# Altium project EMG_MainBoard_Layout.PrjPcb
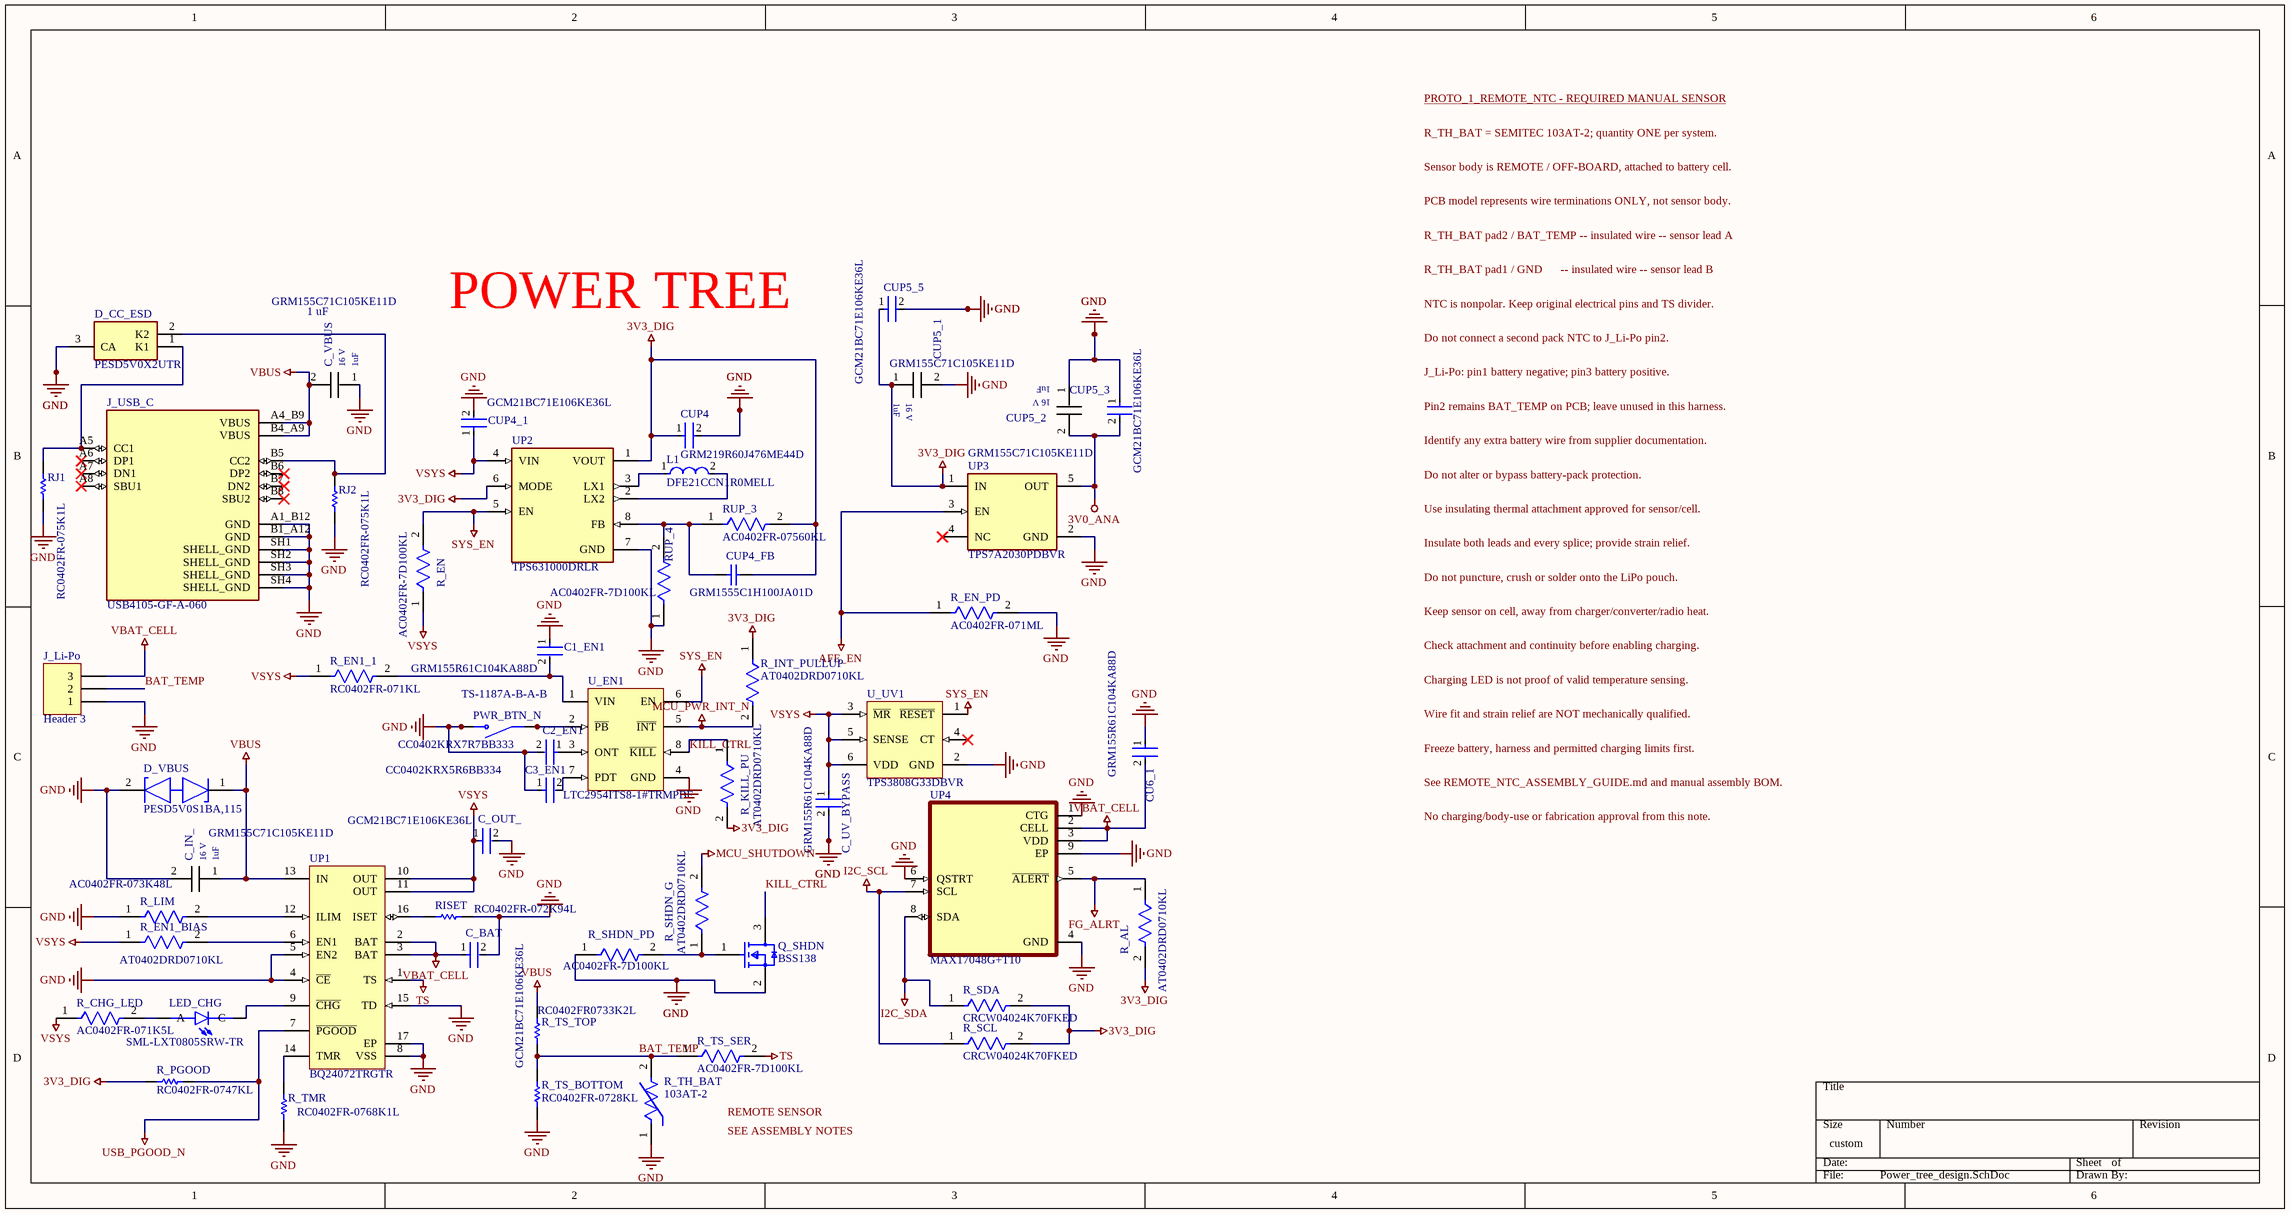
[diagram p0: Power_tree_design.SchDoc]
1 sheet, 54 parts. Net scope: flat (ports and power ports of the same name join across sheets).
Board file: EMG_MainBoard_Layout.PcbDoc

## Sheet Power_tree_design.SchDoc
size 457 x 241 mm; SheetNumber: 7; SheetTotal: 8; SPICEModelCacheDIZSBYRW: <root> / <DocumentId>DIZSBYRW</DocumentId> / </root>

### Parts
C1_EN1  GRM155R61C104KA88D  [FP-GRM155-0_05-IPC_C]
C2_EN1  CC0402KRX7R7BB333  [FP-CC0402-MFG]
C3_EN1  CC0402KRX5R6BB334  [FP-CC0402-MFG]
C_BAT  GCM21BC71E106KE36L  [FP-GCM21B-0_2-e0_2_0_7-MFG]
C_IN_  GRM155C71C105KE11D  [*MURATA_GRM155C71C105KE11D_0]
C_OUT_  GCM21BC71E106KE36L  [FP-GCM21B-0_2-e0_2_0_7-MFG]
C_UV_BYPASS  GRM155R61C104KA88D  [FP-GRM155-0_05-IPC_C]
C_VBUS  GRM155C71C105KE11D  value 1 uF  [*MURATA_GRM155C71C105KE11D_0]
CU6_1  GRM155R61C104KA88D  [FP-GRM155-0_05-IPC_C]
CUP4  GRM219R60J476ME44D  [FP-GRM219-0_2-0_1-IPC_A]
CUP4_1  GCM21BC71E106KE36L  [FP-GCM21B-0_2-e0_2_0_7-MFG]
CUP4_FB  GRM1555C1H100JA01D  [CAPC1005X55X25LL05T10]
CUP5_1  GRM155C71C105KE11D  [*MURATA_GRM155C71C105KE11D_0]
CUP5_2  GRM155C71C105KE11D  [*MURATA_GRM155C71C105KE11D_0]
CUP5_3  GCM21BC71E106KE36L  [FP-GCM21B-0_2-e0_2_0_7-MFG]
CUP5_5  GCM21BC71E106KE36L  [FP-GCM21B-0_2-e0_2_0_7-MFG]
D_CC_ESD  PESD5V0X2UTR  [SOT95P230X100-3N]
D_VBUS  PESD5V0S1BA,115  [FP-SOD323-CA-MFG]
J_Li-Po  Header 3  [HDR1X3]
J_USB_C  USB4105-GF-A-060  [GCT_USB4105-GF-A-060]
L1  DFE21CCN1R0MELL  [FP-DFE21CC_EL-MFG]
LED_CHG  SML-LXT0805SRW-TR  [LEDC2012X120N]
PWR_BTN_N  TS-1187A-B-A-B  [SW_TS-1187A-B-A-B]
Q_SHDN  BSS138  [FP-318-08-IPC_B]
R_AL  AT0402DRD0710KL  [FP-AT0402-IPC_A]
R_CHG_LED  AC0402FR-071K5L  [FP-AC0402-MFG]
R_EN  AC0402FR-7D100KL  [FP-AC0402-MFG]
R_EN1_1  RC0402FR-071KL  [FP-RC0402-0_4-IPC_A]
R_EN1_BIAS  AT0402DRD0710KL  [FP-AT0402-IPC_A]
R_EN_PD  AC0402FR-071ML  [FP-AC0402-IPC_A]
R_INT_PULLUP  AT0402DRD0710KL  [FP-AT0402-IPC_A]
R_KILL_PU  AT0402DRD0710KL  [FP-AT0402-IPC_A]
R_LIM  AC0402FR-073K48L  [FP-AC0402-MFG]
R_PGOOD  RC0402FR-0747KL  [RESC1005X40X25ML05T10]
R_SCL  CRCW04024K70FKED  [FP-CRCW0402-e3-IPC_B]
R_SDA  CRCW04024K70FKED  [FP-CRCW0402-e3-IPC_B]
R_SHDN_G  AT0402DRD0710KL  [FP-AT0402-IPC_A]
R_SHDN_PD  AC0402FR-7D100KL  [FP-AC0402-MFG]
R_TH_BAT  103AT-2  [EMG_REMOTE_NTC_TERMINALS_2P]
R_TMR  RC0402FR-0768K1L  [RESC1005X40X25ML05T10]
R_TS_BOTTOM  RC0402FR-0728KL  [RESC1005X40X25NL05T10]
R_TS_SER  AC0402FR-7D100KL  [FP-AC0402-MFG]
R_TS_TOP  RC0402FR0733K2L  [RESC1005X40X25NL05T10]
RISET  RC0402FR-072K94L  [RESC1005X40X25ML05T10]
RJ1  RC0402FR-075K1L  [RESC1005X40X25NL05T10]
RJ2  RC0402FR-075K1L  [RESC1005X40X25NL05T10]
RUP_3  AC0402FR-07560KL  [FP-AC0402-IPC_A]
RUP_4  AC0402FR-7D100KL  [FP-AC0402-MFG]
U_EN1  LTC2954ITS8-1#TRMPBF  [LT-TS8-8-TSOT-23_V]
U_UV1  TPS3808G33DBVR  [DBV0006A_L]
UP1  BQ24072TRGTR  [RGT0016C_V]
UP2  TPS631000DRLR  [SOT50P160X60-8N]
UP3  TPS7A2030PDBVR  [FP-DBV0005A-IPC_C]
UP4  MAX17048G+T10  [SON50P200X200X80-9N]

### Nets
3V0_ANA: CUP5_2.2 CUP5_3.2 UP3.5(OUT)
3V3_DIG: CUP4.1 CUP4_FB.2 CUP5_1.1 CUP5_5.1 R_AL.2 R_INT_PULLUP.1 R_KILL_PU.2 R_PGOOD.2 R_SCL.2 R_SDA.2 RUP_3.2 UP2.1(VOUT) UP2.6(MODE) UP3.1(IN)
AFE_EN: R_EN_PD.1 UP3.3(EN)
FG_ALRT: R_AL.1 UP4.5(~{ALERT})
GND: C1_EN1.1 C2_EN1.2 C3_EN1.1 C_BAT.2 C_IN_.2 C_OUT_.2 C_UV_BYPASS.2 C_VBUS.1 CU6_1.1 CUP4.2 CUP4_1.2 CUP5_1.2 CUP5_2.1 CUP5_3.1 CUP5_5.2 D_CC_ESD.3(CA) D_VBUS.2(K2) J_Li-Po.1 J_USB_C.A1_B12(GND) J_USB_C.B1_A12(GND) J_USB_C.SH1(SHELL_GND) J_USB_C.SH2(SHELL_GND) J_USB_C.SH3(SHELL_GND) J_USB_C.SH4(SHELL_GND) PWR_BTN_N.C(NO) PWR_BTN_N.D(NO) Q_SHDN.2(S) R_EN_PD.2 R_LIM.1 R_SHDN_PD.1 R_TH_BAT.1 R_TMR.1 R_TS_BOTTOM.1 RISET.2 RJ1.1 RJ2.1 RUP_4.1 U_EN1.4(GND) U_UV1.2(GND) UP1.4(~{CE}) UP1.5(EN2) UP1.8(VSS) UP1.15(TD) UP1.17(EP) UP2.7(GND) UP3.2(GND) UP4.1(CTG) UP4.4(GND) UP4.6(QSTRT) UP4.9(EP)
I2C_SCL: R_SCL.1 UP4.7(SCL)
I2C_SDA: R_SDA.1 UP4.8(SDA)
MCU_PWR_INT_N: R_INT_PULLUP.2 U_EN1.5(~{INT})
MCU_SHUTDOWN: R_SHDN_G.2
SYS_EN: R_EN.2 U_EN1.6(EN) U_UV1.1(~{RESET}) UP2.5(EN)
TS: R_TS_SER.2 UP1.1(TS)
USB_PGOOD_N: R_PGOOD.1 UP1.7(~{PGOOD})
VBAT_CELL: C_BAT.1 CU6_1.2 J_Li-Po.3 UP1.2(BAT) UP1.3(BAT) UP4.2(CELL) UP4.3(VDD)
VBUS: C_IN_.1 C_VBUS.2 D_VBUS.1(K1) J_USB_C.A4_B9(VBUS) J_USB_C.B4_A9(VBUS) R_TS_TOP.2 UP1.13(IN)
VSYS: C_OUT_.1 C_UV_BYPASS.1 CUP4_1.1 R_CHG_LED.1 R_EN.1 R_EN1_1.1 R_EN1_BIAS.1 U_UV1.3(~{MR}) U_UV1.5(SENSE) U_UV1.6(VDD) UP1.10(OUT) UP1.11(OUT) UP2.4(VIN)
BAT_TEMP: J_Li-Po.2 R_TH_BAT.2 R_TS_BOTTOM.2 R_TS_SER.1 R_TS_TOP.1
KILL_CTRL: Q_SHDN.3(D) R_KILL_PU.1 U_EN1.8(~{KILL})
NetC1_EN1_2: C1_EN1.2 R_EN1_1.2 U_EN1.1(VIN)
NetC2_EN1_1: C2_EN1.1 U_EN1.3(ONT)
NetC3_EN1_2: C3_EN1.2 U_EN1.7(PDT)
NetCUP4_FB_1: CUP4_FB.1 RUP_3.1 RUP_4.2 UP2.8(FB)
NetD_CC_ESD_1: D_CC_ESD.1(K1) J_USB_C.A5(CC1) RJ1.2
NetD_CC_ESD_2: D_CC_ESD.2(K2) J_USB_C.B5(CC2) RJ2.2
NetL1_1: L1.1 UP2.3(LX1)
NetL1_2: L1.2 UP2.2(LX2)
NetLED_CHG_A: LED_CHG.A R_CHG_LED.2
NetLED_CHG_C: LED_CHG.C UP1.9(~{CHG})
NetPWR_BTN_N_A: PWR_BTN_N.A(COM) PWR_BTN_N.B(COM) U_EN1.2(~{PB})
NetQ_SHDN_1: Q_SHDN.1(G) R_SHDN_G.1 R_SHDN_PD.2
NetR_EN1_BIAS_2: R_EN1_BIAS.2 UP1.6(EN1)
NetR_LIM_2: R_LIM.2 UP1.12(ILIM)
NetR_TMR_2: R_TMR.2 UP1.14(TMR)
NetRISET_1: RISET.1 UP1.16(ISET)

Not connected (* = marked no-connect by the designer): J_USB_C A6(DP1)* A7(DN1)* A8(SBU1)* B6(DP2)* B7(DN2)* B8(SBU2)*; U_UV1 4(CT)*; UP3 4(NC)*

### Notes on the sheet
- PROTO_1_REMOTE_NTC - REQUIRED MANUAL SENSOR
- R_TH_BAT = SEMITEC 103AT-2; quantity ONE per system.
- Sensor body is REMOTE / OFF-BOARD, attached to battery cell.
- PCB model represents wire terminations ONLY, not sensor body.
- R_TH_BAT pad2 / BAT_TEMP -- insulated wire -- sensor lead A
- R_TH_BAT pad1 / GND      -- insulated wire -- sensor lead B
- POWER TREE
- NTC is nonpolar. Keep original electrical pins and TS divider.
- Do not connect a second pack NTC to J_Li-Po pin2.
- J_Li-Po: pin1 battery negative; pin3 battery positive.
- Pin2 remains BAT_TEMP on PCB; leave unused in this harness.
- Identify any extra battery wire from supplier documentation.
- Do not alter or bypass battery-pack protection.
- Use insulating thermal attachment approved for sensor/cell.
- Insulate both leads and every splice; provide strain relief.
- Do not puncture, crush or solder onto the LiPo pouch.
- Keep sensor on cell, away from charger/converter/radio heat.
- Check attachment and continuity before enabling charging.
- Charging LED is not proof of valid temperature sensing.
- Wire fit and strain relief are NOT mechanically qualified.
- Freeze battery, harness and permitted charging limits first.
- See REMOTE_NTC_ASSEMBLY_GUIDE.md and manual assembly BOM.
- No charging/body-use or fabrication approval from this note.
- REMOTE SENSOR
- SEE ASSEMBLY NOTES
- (in symbol EMG_R5_C_IN_) 1uF
- (in symbol EMG_R5_C_VBUS) 1uF
- (in symbol EMG_R5_CUP5_1) 1uF
- (in symbol EMG_R5_CUP5_2) 1uF

### Library data of the parts
C1_EN1 = EMG_R5_C1_EN1: CAP CER 0.1UF 16V X5R 0402; Tolerance: 10%; Capacitance: 100nF; Controlled Revision: R5 2026-09-16; project-local frozen symbol/footprint; Size: 0.5mm; Case Code (Imperial): 0402; Voltage: 16V; REACH SVHC: No SVHC; Packaging: Tape and Reel; Case/Package: 0402; Package Quantity: 1; Max Operating Temperature: 85°C; Voltage Rating (DC): 16V; Min Operating Temperature: -55°C; Construction: Flat; Mount: Surface Mount; Voltage Rating: 16V; Thickness: 0.022inch; Depth: 0.5mm; Termination: SMD/SMT; Length: 1mm; Height: 0.5mm; Series: GRM; Radiation Hardening: No; Width: 0.02inch; RoHS Compliant: Yes; Lead Free: Lead Free; Case Code (Metric): 1005; Dielectric: X5R
C2_EN1 = EMG_R5_C2_EN1: CAP CER 0.033UF 16V X7R 0402; Manufacturer: YAGEO; Temperature Coefficient: 30ppm/°C; Material: Ceramic; Capacitance: 33 nF; Tolerance: 0.1; Value: 33 nF; Automotive Grade: NA; Controlled Revision: R5 2026-09-16; project-local frozen symbol/footprint; Height: 0.55mm; Footprint Url: http://www.yageo.com/exep/pages/download/literatures/UPY-C_GEN_24.pdf; Voltage Rating: 16 V; ComponentLink2URL: http://www.yageo.com/documents/recent/UPY-GP_NP0_16V-to-50V_16.pdf; Temperature Characteristic: X7R; Temperature Range High: +125°C; Package: CC0402; Digikey Description: CAP CER 0.033UF 16V X7R 0402; Device Class L3: Ceramic Capacitors; Device Class L1: Passive Components; Mouser Description: Multilayer Ceramic Capacitors MLCC - SMD/SMT 33nF 16V X7R 10%; Manufacturer Part Number: CC0402KRX7R7BB333; RoHS: TRUE; Octopart: https://octopart.com/cc0402krx7r7bb333-yageo-9289202; Temperature Range Low: -55°C; Temperature: -55°C to +125°C; Device Class L2: Capacitors; Category: Cap; Lead Free: Yes; Automotive: No; ComponentLink2Description: Datasheet; Ipc Land Pattern Name: CAPC10050X50
C3_EN1 = EMG_R5_C3_EN1: CAP CER 0.33UF 10V X5R 0402; Manufacturer: YAGEO; Automotive Grade: NA; Value: 330 nF; Temperature Coefficient: 30ppm/°C; Material: Ceramic; Tolerance: 0.1; Controlled Revision: R5 2026-09-16; project-local frozen symbol/footprint; ComponentLink2URL: http://www.yageo.com/documents/recent/UPY-GP_NP0_16V-to-50V_16.pdf; Device Class L2: Capacitors; Voltage Rating: 10 V; ComponentLink2Description: Datasheet; Package: CC0402; Device Class L3: Ceramic Capacitors; Digikey Description: CAP CER 0.33UF 10V X5R 0402; Device Class L1: Passive Components; Footprint Url: http://www.yageo.com/exep/pages/download/literatures/UPY-C_GEN_24.pdf; Temperature Characteristic: X5R; Octopart: https://octopart.com/cc0402krx5r6bb334-yageo-21548561; Automotive: No; Temperature: -55°C to +125°C; Lead Free: Yes; Temperature Range Low: -55°C; Height: 0.55mm; Ipc Land Pattern Name: CAPC10050X50; Category: Cap; Capacitance: 330 nF; Manufacturer Part Number: CC0402KRX5R6BB334; RoHS: TRUE; Mouser Description: 0402 330 nF 10 V ±10 % Tolerance X5R SMT Multilayer Ceramic Capacitor; Temperature Range High: +125°C
C_BAT = EMG_R5_C_BAT: 10 µF ±10% 25V Ceramic Capacitor X7S 0805 (2012 Metric); Controlled Revision: R5 2026-09-16; project-local frozen symbol/footprint
C_IN_ = EMG_R5_C_IN_: Murata GRM155C71C105KE11D: 1 uF 16 V X7S +/-10%, 0402/1005 metric; Value: 1 uF; Controlled Revision: R5 2026-09-16; project-local frozen symbol/footprint; Voltage Rating: 16 V; SnapEDA_Link: https://www.snapeda.com/parts/GRM155C71C105KE11D/Murata/view-part/?ref=snap; Package: 0402 / 1005 metric; MF: Murata; MP: GRM155C71C105KE11D; Check_prices: https://www.snapeda.com/parts/GRM155C71C105KE11D/Murata/view-part/?ref=eda; Manufacturer: Murata; Manufacturer Part Number: GRM155C71C105KE11D; Capacitance: 1 uF; Dielectric: X7S; Tolerance: +/-10%
C_OUT_ = EMG_R5_C_OUT_: 10 µF ±10% 25V Ceramic Capacitor X7S 0805 (2012 Metric); Controlled Revision: R5 2026-09-16; project-local frozen symbol/footprint
C_UV_BYPASS = EMG_R5_C_UV_BYPASS: CAP CER 0.1UF 16V X5R 0402; Tolerance: 10%; Capacitance: 100nF; Controlled Revision: R5 2026-09-16; project-local frozen symbol/footprint; Size: 0.5mm; Case Code (Imperial): 0402; Voltage: 16V; REACH SVHC: No SVHC; Packaging: Tape and Reel; Case/Package: 0402; Package Quantity: 1; Max Operating Temperature: 85°C; Voltage Rating (DC): 16V; Min Operating Temperature: -55°C; Construction: Flat; Mount: Surface Mount; Voltage Rating: 16V; Thickness: 0.022inch; Depth: 0.5mm; Termination: SMD/SMT; Length: 1mm; Height: 0.5mm; Series: GRM; Radiation Hardening: No; Width: 0.02inch; RoHS Compliant: Yes; Lead Free: Lead Free; Case Code (Metric): 1005; Dielectric: X5R
C_VBUS = EMG_R5_C_VBUS: Murata GRM155C71C105KE11D: 1 uF 16 V X7S +/-10%, 0402/1005 metric; Controlled Revision: R5 2026-09-16; project-local frozen symbol/footprint; Voltage Rating: 16 V; SnapEDA_Link: https://www.snapeda.com/parts/GRM155C71C105KE11D/Murata/view-part/?ref=snap; Package: 0402 / 1005 metric; MF: Murata; MP: GRM155C71C105KE11D; Check_prices: https://www.snapeda.com/parts/GRM155C71C105KE11D/Murata/view-part/?ref=eda; Manufacturer: Murata; Manufacturer Part Number: GRM155C71C105KE11D; Capacitance: 1 uF; Dielectric: X7S; Tolerance: +/-10%
CU6_1 = EMG_R5_CU6_1: CAP CER 0.1UF 16V X5R 0402; Tolerance: 10%; Capacitance: 100nF; Controlled Revision: R5 2026-09-16; project-local frozen symbol/footprint; Size: 0.5mm; Case Code (Imperial): 0402; Voltage: 16V; REACH SVHC: No SVHC; Packaging: Tape and Reel; Case/Package: 0402; Package Quantity: 1; Max Operating Temperature: 85°C; Voltage Rating (DC): 16V; Min Operating Temperature: -55°C; Construction: Flat; Mount: Surface Mount; Voltage Rating: 16V; Thickness: 0.022inch; Depth: 0.5mm; Termination: SMD/SMT; Length: 1mm; Height: 0.5mm; Series: GRM; Radiation Hardening: No; Width: 0.02inch; RoHS Compliant: Yes; Lead Free: Lead Free; Case Code (Metric): 1005; Dielectric: X5R
CUP4 = EMG_R5_CUP4: Chip Multilayer Ceramic Capacitors for General Purpose, 0805, 47uF, X5R, 15%, 20%, 6.3V; Controlled Revision: R5 2026-09-16; project-local frozen symbol/footprint; Case Code (Metric): 2012; Voltage Rating: 6.3V; Case Code (Imperial): 0805; Max Operating Temperature: 85°C; Width: 0.049inch; Length: 0.079inch; Min Operating Temperature: -55°C; Mount: Surface Mount; Packaging: Tape and Reel; Case/Package: 0805; Thickness: 0.037inch; Capacitance: 47uF; Tolerance: 20%
CUP4_1 = EMG_R5_CUP4_1: 10 µF ±10% 25V Ceramic Capacitor X7S 0805 (2012 Metric); Controlled Revision: R5 2026-09-16; project-local frozen symbol/footprint
CUP4_FB = EMG_R5_CUP4_FB: Manufacturer: Murata; Controlled Revision: R5 2026-09-16; project-local frozen symbol/footprint; Part Number: GRM1555C1H100JA01D
CUP5_1 = EMG_R5_CUP5_1: Murata GRM155C71C105KE11D: 1 uF 16 V X7S +/-10%, 0402/1005 metric; Value: 1 uF; Controlled Revision: R5 2026-09-16; project-local frozen symbol/footprint; Voltage Rating: 16 V; SnapEDA_Link: https://www.snapeda.com/parts/GRM155C71C105KE11D/Murata/view-part/?ref=snap; Package: 0402 / 1005 metric; MF: Murata; MP: GRM155C71C105KE11D; Check_prices: https://www.snapeda.com/parts/GRM155C71C105KE11D/Murata/view-part/?ref=eda; Manufacturer: Murata; Manufacturer Part Number: GRM155C71C105KE11D; Capacitance: 1 uF; Dielectric: X7S; Tolerance: +/-10%
CUP5_2 = EMG_R5_CUP5_2: Murata GRM155C71C105KE11D: 1 uF 16 V X7S +/-10%, 0402/1005 metric; Value: 1 uF; Controlled Revision: R5 2026-09-16; project-local frozen symbol/footprint; Voltage Rating: 16 V; SnapEDA_Link: https://www.snapeda.com/parts/GRM155C71C105KE11D/Murata/view-part/?ref=snap; Package: 0402 / 1005 metric; MF: Murata; MP: GRM155C71C105KE11D; Check_prices: https://www.snapeda.com/parts/GRM155C71C105KE11D/Murata/view-part/?ref=eda; Manufacturer: Murata; Manufacturer Part Number: GRM155C71C105KE11D; Capacitance: 1 uF; Dielectric: X7S; Tolerance: +/-10%
CUP5_3 = EMG_R5_CUP5_3: 10 µF ±10% 25V Ceramic Capacitor X7S 0805 (2012 Metric); Controlled Revision: R5 2026-09-16; project-local frozen symbol/footprint
CUP5_5 = EMG_R5_CUP5_5: 10 µF ±10% 25V Ceramic Capacitor X7S 0805 (2012 Metric); Controlled Revision: R5 2026-09-16; project-local frozen symbol/footprint
D_CC_ESD = EMG_R5_D_CC_ESD: TVS Diode (Uni-directional); Manufacturer_Name: Nexperia; Controlled Revision: R5 2026-09-16; project-local frozen symbol/footprint; Datasheet Link: https://assets.nexperia.com/documents/data-sheet/PESD5V0X2UT.pdf; Height: 1mm; Manufacturer_Part_Number: PESD5V0X2UTR
D_VBUS = EMG_R5_D_VBUS: TVS DIODE 5V 14V SOD323; Controlled Revision: R5 2026-09-16; project-local frozen symbol/footprint
J_Li-Po = EMG_R5_J_Li-Po: Header, 3-Pin; Production Release Blocker: Freeze exact orderable manufacturer/MPN, package/mating/contact definition before production; do not infer from generic symbol.; Controlled Revision: R5 2026-09-16; project-local frozen symbol/footprint; LatestRevisionDate: 17-Jul-2002; LatestRevisionNote: Re-released for DXP Platform.; Publisher: Altium Limited
J_USB_C = EMG_R5_J_USB_C: USB-C (USB TYPE-C) USB 2.0 Receptacle Connector 24 (16+8 Dummy) Position Surface Mount, Right Angle; Through Hole; MF: Global Connector Technology; MP: USB4105GFA060; Controlled Revision: R5 2026-09-16; project-local frozen symbol/footprint; SnapEDA_Link: https://www.snapeda.com/parts/USB4105GFA060/Global+Connector+Technology/view-part/?ref=snap; Package: None; Value: *; Check_prices: https://www.snapeda.com/parts/USB4105GFA060/Global+Connector+Technology/view-part/?ref=eda
L1 = EMG_R5_L1: FIXED IND 1.0UH 3300MA NONAUTO; Controlled Revision: R5 2026-09-16; project-local frozen symbol/footprint
LED_CHG = EMG_R5_LED_CHG: Red - LED Indication - Discrete 1.8V 0805 (2012 Metric); MF: Lumex Opto/Components; Controlled Revision: R5 2026-09-16; project-local frozen symbol/footprint; SnapEDA_Link: https://www.snapeda.com/parts/SML-LXT0805SRW-TR/Lumex/view-part/?ref=snap; Package: 0805 Lumex; Value: *; MP: SML-LXT0805SRW-TR; Check_prices: https://www.snapeda.com/parts/SML-LXT0805SRW-TR/Lumex/view-part/?ref=eda
PWR_BTN_N = EMG_R5_PWR_BTN_N: SPST 50mA @ 12VDC Top Actuated Round Button 160gf SMD Tactile Switches RoHS; Controlled Revision: R5 2026-09-16; project-local frozen symbol/footprint; Production Release Blocker: Freeze exact orderable manufacturer/MPN, package/mating/contact definition before production; do not infer from generic symbol.; MP: TS-1187A-B-A-B; Value: *; Price: None; Package: None; Availability: Unavailable
Q_SHDN = EMG_R5_Q_SHDN: MOSFET N-CH 50V 220MA SOT-23; Turn-Off Delay Time: 20ns; Element Configuration: Single; Rds On Max: 3.5R; Gate to Source Voltage (Vgs): 20V; Threshold Voltage: 1.3V; Number of Elements: 1; Power Dissipation: 360mW; Rise Time: 9ns; Turn-On Delay Time: 2.5ns; Input Capacitance: 27pF; On-State Resistance: 6R; Controlled Revision: R5 2026-09-16; project-local frozen symbol/footprint; Production Release Blocker: Freeze exact orderable manufacturer/MPN, package/mating/contact definition before production; do not infer from generic symbol.; Lead Free: Lead Free; Length: 2.92mm; Width: 1.3mm; Drain to Source Breakdown Voltage: 50V; Min Operating Temperature: -55°C; REACH SVHC: No SVHC; Packaging: Tape and Reel; Radiation Hardening: No; Height: 0.93mm; Drain to Source Voltage (Vdss): 50V; Current Rating: 220mA; Voltage Rating (DC): 50V; Weight: 0.03g; Continuous Drain Current (ID): 220mA; Number of Pins: 3; Nominal Vgs: 1.3V; Max Power Dissipation: 360mW; Fall Time: 9ns; Drain to Source Resistance: 3.5R; Contact Plating: Tin; Case/Package: SOT-23; Package Quantity: 1; Dual Supply Voltage: 50V; Mount: Surface Mount; Termination: SMD/SMT; Max Operating Temperature: 150°C
R_AL = EMG_R5_R_AL: Thin Film Chip Resistors Automotive Grade 10kΩ 0.5% 25ppm/°C 0402; Resistance: 10kR; Max Power Dissipation: 63mW; Controlled Revision: R5 2026-09-16; project-local frozen symbol/footprint; Tolerance: 0.5%; Temperature Coefficient: 25ppm/°C; Width: 0.02inch; RoHS Compliant: Yes; Min Operating Temperature: -55°C; Height: 0.014inch; Case Code (Metric): 1005; Ratings: AEC-Q200; Case/Package: 0402; Max Operating Temperature: 155°C; Number of Terminations: 2; Features: Moisture Resistant; Packaging: Cut Tape; Length: 0.039inch; Series: AT; Resistor Type: Thin Film; Case Code (Imperial): 0402
R_CHG_LED = EMG_R5_R_CHG_LED: RES 1.5kΩ ±1% 0.063W 0402; Max Power Dissipation: 63mW; Voltage Rating: 50V; Resistance: 1.5kR; Temperature Coefficient: 100ppm/°C; Power Rating: 62.5mW; Controlled Revision: R5 2026-09-16; project-local frozen symbol/footprint; Min Operating Temperature: -55°C; Features: Moisture Resistant; Series: AC; Mount: Surface Mount; Case Code (Metric): 1005; Termination: SMD/SMT; Size Code: 0402; Max Operating Temperature: 155°C; Tolerance: 1%; Resistor Type: Thick Film; Height: 0.015inch; Packaging: Tape and Reel; Length: 0.039inch; Width: 0.5mm; Case Code (Imperial): 0402; Lead Free: Lead Free; Case/Package: 0402; Number of Terminations: 2; RoHS Compliant: Yes
R_EN = EMG_R5_R_EN: AC0402 100KΩ 0.0625W 1.00%; Manufacturer: Yageo; Automotive Grade: Grade 0; Voltage Rating: 50V; Tolerance: 0.01; Controlled Revision: R5 2026-09-16; project-local frozen symbol/footprint; Resistance: 100KΩ; Automotive: Yes; Device Class L1: Passive Components; Temperature Range High: +155°C; ComponentLink2URL: http://www.yageo.com/documents/recent/PYu-AC_51_RoHS_L_6.pdf; Footprint Url: http://www.yageo.com/exep/pages/download/literatures/PYu-R_Mount_10.pdf; Power Rating: 0.0625W; RoHS: TRUE; Category: Res; Package: AC0402; Octopart: https://octopart.com/ac0402fr-7d100kl-yageo-91024821; Device Class L2: Resistors; Series: AC; Height: 0.37mm; ComponentLink2Description: Datasheet; Lead Free: Yes; Temperature Range Low: -55°C; Value: 100KΩ; Temperature: -55°C to +155°C; Ipc Land Pattern Name: RESC10050X32; Device Class L3: Chip SMD Resistors; Manufacturer Part Number: AC0402FR-7D100KL; Composition: Thick Film
R_EN1_1 = EMG_R5_R_EN1_1: RES 1K OHM 1% 1/16W 0402; Max Power Dissipation: 63mW; Resistance: 1kR; Voltage Rating (DC): 50V; Temperature Coefficient: 100ppm/°C; Power Rating: 62.5mW; Controlled Revision: R5 2026-09-16; project-local frozen symbol/footprint; Technology: THICK FILM; Size Code: 0402; Series: RC; Length: 1mm; Case/Package: 0402; Features: Moisture Resistant; Termination: SMD/SMT; Case Code (Metric): 1005; Reach SVHC Compliant: Yes; Number of Terminations: 2; Tolerance: 1%; Lead Free: Lead Free; Military Standard: Not; Resistor Type: Thick Film; Max Operating Temperature: 155°C; RoHS Compliant: Yes; Construction: Rectangular; Voltage Rating: 50V; Packaging: Tape and Reel; Height: 0.32mm; Number of Pins: 2; Resistance Tolerance: 1%; Case Code (Imperial): 0402; Depth: 0.5mm; Min Operating Temperature: -55°C; Width: 0.5mm
R_EN1_BIAS = EMG_R5_R_EN1_BIAS: Thin Film Chip Resistors Automotive Grade 10kΩ 0.5% 25ppm/°C 0402; Resistance: 10kR; Max Power Dissipation: 63mW; Controlled Revision: R5 2026-09-16; project-local frozen symbol/footprint; Tolerance: 0.5%; Temperature Coefficient: 25ppm/°C; Width: 0.02inch; RoHS Compliant: Yes; Min Operating Temperature: -55°C; Height: 0.014inch; Case Code (Metric): 1005; Ratings: AEC-Q200; Case/Package: 0402; Max Operating Temperature: 155°C; Number of Terminations: 2; Features: Moisture Resistant; Packaging: Cut Tape; Length: 0.039inch; Series: AT; Resistor Type: Thin Film; Case Code (Imperial): 0402
R_EN_PD = EMG_R5_R_EN_PD: RES 1MΩ ±1% 0.063W 0402; Power Rating: 62.5mW; Max Power Dissipation: 63mW; Temperature Coefficient: 100ppm/°C; Resistance: 1MR; Voltage Rating: 50V; Controlled Revision: R5 2026-09-16; project-local frozen symbol/footprint; Packaging: Tape and Reel; Lead Free: Lead Free; Depth: 0.5mm; Series: AC; Length: 0.039inch; Resistor Type: Thick Film; Termination: SMD/SMT; Military Standard: Not; Case/Package: 0402; Min Operating Temperature: -55°C; Tolerance: 1%; Features: Moisture Resistant; Size Code: 0402; Case Code (Imperial): 0402; Number of Terminations: 2; Width: 0.5mm; Construction: Rectangular; Height: 0.015inch; RoHS Compliant: Yes; Case Code (Metric): 1005; Max Operating Temperature: 155°C
R_INT_PULLUP = EMG_R5_R_INT_PULLUP: Thin Film Chip Resistors Automotive Grade 10kΩ 0.5% 25ppm/°C 0402; Resistance: 10kR; Max Power Dissipation: 63mW; Controlled Revision: R5 2026-09-16; project-local frozen symbol/footprint; Tolerance: 0.5%; Temperature Coefficient: 25ppm/°C; Width: 0.02inch; RoHS Compliant: Yes; Min Operating Temperature: -55°C; Height: 0.014inch; Case Code (Metric): 1005; Ratings: AEC-Q200; Case/Package: 0402; Max Operating Temperature: 155°C; Number of Terminations: 2; Features: Moisture Resistant; Packaging: Cut Tape; Length: 0.039inch; Series: AT; Resistor Type: Thin Film; Case Code (Imperial): 0402
R_KILL_PU = EMG_R5_R_KILL_PU: Thin Film Chip Resistors Automotive Grade 10kΩ 0.5% 25ppm/°C 0402; Resistance: 10kR; Max Power Dissipation: 63mW; Controlled Revision: R5 2026-09-16; project-local frozen symbol/footprint; Tolerance: 0.5%; Temperature Coefficient: 25ppm/°C; Width: 0.02inch; RoHS Compliant: Yes; Min Operating Temperature: -55°C; Height: 0.014inch; Case Code (Metric): 1005; Ratings: AEC-Q200; Case/Package: 0402; Max Operating Temperature: 155°C; Number of Terminations: 2; Features: Moisture Resistant; Packaging: Cut Tape; Length: 0.039inch; Series: AT; Resistor Type: Thin Film; Case Code (Imperial): 0402
R_LIM = EMG_R5_R_LIM: RES 3.48kΩ ±1% 0.063W 0402; Resistance: 3.48kR; Temperature Coefficient: 100ppm/°C; Max Power Dissipation: 63mW; Controlled Revision: R5 2026-09-16; project-local frozen symbol/footprint; Features: Moisture Resistant; Case/Package: 0402; Tolerance: 1%; Case Code (Metric): 1005; Series: AC; Ratings: AEC-Q200; Resistor Type: Thick Film; Width: 0.02inch; Packaging: Tape and Reel; RoHS Compliant: Yes; Number of Terminations: 2; Case Code (Imperial): 0402; Height: 0.015inch; Length: 0.039inch; Max Operating Temperature: 155°C; Min Operating Temperature: -55°C
R_PGOOD = EMG_R5_R_PGOOD: Manufacturer: Yageo / Phycomp; Controlled Revision: R5 2026-09-16; project-local frozen symbol/footprint; Part Number: RC0402FR-0747KL
R_SCL = EMG_R5_R_SCL: RES Thick Film, 4.7kΩ, 1%, 0.063W, 100ppm/°C, 0402; Voltage Rating (DC): 50V; Power Rating: 63mW; Resistance: 4.7kR; Controlled Revision: R5 2026-09-16; project-local frozen symbol/footprint; Termination: SMD/SMT; Military Standard: Not; Length: 1mm; Radiation Hardening: No; Max Operating Temperature: 155°C; Min Operating Temperature: -55°C; Package Quantity: 10; Width: 0.5mm; Case Code (Imperial): 0402; Number of Terminations: 2; Max Power Dissipation: 63mW; Tolerance: 1%; Features: Automotive AEC-Q200; Composition: Thick Film; Depth: 0.5mm; Mount: Surface Mount; Weight: 2.3E-05oz; Lead Free: Lead Free; Case/Package: 0402; Height: 0.35mm; Packaging: Tape and Reel; Temperature Coefficient: 100ppm/°C; Case Code (Metric): 1005; Voltage Rating: 50V; Contact Plating: Tin
R_SDA = EMG_R5_R_SDA: RES Thick Film, 4.7kΩ, 1%, 0.063W, 100ppm/°C, 0402; Voltage Rating (DC): 50V; Power Rating: 63mW; Resistance: 4.7kR; Controlled Revision: R5 2026-09-16; project-local frozen symbol/footprint; Termination: SMD/SMT; Military Standard: Not; Length: 1mm; Radiation Hardening: No; Max Operating Temperature: 155°C; Min Operating Temperature: -55°C; Package Quantity: 10; Width: 0.5mm; Case Code (Imperial): 0402; Number of Terminations: 2; Max Power Dissipation: 63mW; Tolerance: 1%; Features: Automotive AEC-Q200; Composition: Thick Film; Depth: 0.5mm; Mount: Surface Mount; Weight: 2.3E-05oz; Lead Free: Lead Free; Case/Package: 0402; Height: 0.35mm; Packaging: Tape and Reel; Temperature Coefficient: 100ppm/°C; Case Code (Metric): 1005; Voltage Rating: 50V; Contact Plating: Tin
R_SHDN_G = EMG_R5_R_SHDN_G: Thin Film Chip Resistors Automotive Grade 10kΩ 0.5% 25ppm/°C 0402; Resistance: 10kR; Max Power Dissipation: 63mW; Controlled Revision: R5 2026-09-16; project-local frozen symbol/footprint; Tolerance: 0.5%; Temperature Coefficient: 25ppm/°C; Width: 0.02inch; RoHS Compliant: Yes; Min Operating Temperature: -55°C; Height: 0.014inch; Case Code (Metric): 1005; Ratings: AEC-Q200; Case/Package: 0402; Max Operating Temperature: 155°C; Number of Terminations: 2; Features: Moisture Resistant; Packaging: Cut Tape; Length: 0.039inch; Series: AT; Resistor Type: Thin Film; Case Code (Imperial): 0402
R_SHDN_PD = EMG_R5_R_SHDN_PD: AC0402 100KΩ 0.0625W 1.00%; Manufacturer: Yageo; Automotive Grade: Grade 0; Voltage Rating: 50V; Tolerance: 0.01; Controlled Revision: R5 2026-09-16; project-local frozen symbol/footprint; Resistance: 100KΩ; Automotive: Yes; Device Class L1: Passive Components; Temperature Range High: +155°C; ComponentLink2URL: http://www.yageo.com/documents/recent/PYu-AC_51_RoHS_L_6.pdf; Footprint Url: http://www.yageo.com/exep/pages/download/literatures/PYu-R_Mount_10.pdf; Power Rating: 0.0625W; RoHS: TRUE; Category: Res; Package: AC0402; Octopart: https://octopart.com/ac0402fr-7d100kl-yageo-91024821; Device Class L2: Resistors; Series: AC; Height: 0.37mm; ComponentLink2Description: Datasheet; Lead Free: Yes; Temperature Range Low: -55°C; Value: 100KΩ; Temperature: -55°C to +155°C; Ipc Land Pattern Name: RESC10050X32; Device Class L3: Chip SMD Resistors; Manufacturer Part Number: AC0402FR-7D100KL; Composition: Thick Film
R_TH_BAT = EMG_R5_R_TH_BAT: Required remote cell-temperature NTC; manual off-board assembly; Manufacturer: SEMITEC Corporation; Resistance: 10 kohm at 25 C; Tolerance: +/-1% at 25 C; Beta B25/85: 3435 K +/-1%; Mounting_Location: Battery cell / off-board; Connection: Two insulated leads to R_TH_BAT pads: pad1 GND, pad2 BAT_TEMP; PCB_Auto_Assembly: Exclude - required manual off-board assembly item; Procurement_Quantity_Per_System: 1; Assembly PROTO_1_REMOTE_NTC: Required - manual remote assembly; Release Note: Only one connected NTC. Do not connect a second pack NTC to J_Li-Po pin2. Wire fit, insulation, cell attachment and strain relief require qualification.; Controlled Revision: Remote NTC 2026-09-16; project-local symbol and wire-termination model; Manufacturer Part Number: 103AT-2; Series: AT; Package: AT-2 resin-coated radial thermistor; body mounted on cell; Assembly_Method: Manual; Population: Required; Datasheet: https://www.semitec-global.com/uploads/2022/01/P12-13-AT-Thermistor.pdf; Library Name: EMG_Controlled_R5.SchLib
R_TMR = EMG_R5_R_TMR: Manufacturer: Yageo / Phycomp; Controlled Revision: R5 2026-09-16; project-local frozen symbol/footprint; Part Number: RC0402FR-0768K1L
R_TS_BOTTOM = EMG_R5_R_TS_BOTTOM: Manufacturer: Yageo; Controlled Revision: R5 2026-09-16; project-local frozen symbol/footprint; Part Number: RC0402FR-0728KL
R_TS_SER = EMG_R5_R_TS_SER: AC0402 100KΩ 0.0625W 1.00%; Manufacturer: Yageo; Automotive Grade: Grade 0; Voltage Rating: 50V; Tolerance: 0.01; Controlled Revision: R5 2026-09-16; project-local frozen symbol/footprint; Resistance: 100KΩ; Automotive: Yes; Device Class L1: Passive Components; Temperature Range High: +155°C; ComponentLink2URL: http://www.yageo.com/documents/recent/PYu-AC_51_RoHS_L_6.pdf; Footprint Url: http://www.yageo.com/exep/pages/download/literatures/PYu-R_Mount_10.pdf; Power Rating: 0.0625W; RoHS: TRUE; Category: Res; Package: AC0402; Octopart: https://octopart.com/ac0402fr-7d100kl-yageo-91024821; Device Class L2: Resistors; Series: AC; Height: 0.37mm; ComponentLink2Description: Datasheet; Lead Free: Yes; Temperature Range Low: -55°C; Value: 100KΩ; Temperature: -55°C to +155°C; Ipc Land Pattern Name: RESC10050X32; Device Class L3: Chip SMD Resistors; Manufacturer Part Number: AC0402FR-7D100KL; Composition: Thick Film
R_TS_TOP = EMG_R5_R_TS_TOP: Manufacturer: Yageo / Phycomp; Controlled Revision: R5 2026-09-16; project-local frozen symbol/footprint; Part Number: RC0402FR0733K2L
RISET = EMG_R5_RISET: Manufacturer: Yageo; Controlled Revision: R5 2026-09-16; project-local frozen symbol/footprint; Part Number: RC0402FR-072K94L
RJ1 = EMG_R5_RJ1: Manufacturer: Yageo / Phycomp; Controlled Revision: R5 2026-09-16; project-local frozen symbol/footprint; Part Number: RC0402FR-075K1L
RJ2 = EMG_R5_RJ2: Manufacturer: Yageo / Phycomp; Controlled Revision: R5 2026-09-16; project-local frozen symbol/footprint; Part Number: RC0402FR-075K1L
RUP_3 = EMG_R5_RUP_3: RES 560kΩ ±1% 0.063W 0402; Max Power Dissipation: 63mW; Temperature Coefficient: 100ppm/°C; Resistance: 560kR; Controlled Revision: R5 2026-09-16; project-local frozen symbol/footprint; Number of Terminations: 2; Series: AC; Features: Moisture Resistant; Max Operating Temperature: 155°C; RoHS Compliant: Yes; Case/Package: 0402; Min Operating Temperature: -55°C; Width: 0.02inch; Packaging: Tape and Reel; Length: 0.039inch; Height: 0.015inch; Resistor Type: Thick Film; Tolerance: 1%
RUP_4 = EMG_R5_RUP_4: AC0402 100KΩ 0.0625W 1.00%; Manufacturer: Yageo; Automotive Grade: Grade 0; Voltage Rating: 50V; Tolerance: 0.01; Controlled Revision: R5 2026-09-16; project-local frozen symbol/footprint; Resistance: 100KΩ; Automotive: Yes; Device Class L1: Passive Components; Temperature Range High: +155°C; ComponentLink2URL: http://www.yageo.com/documents/recent/PYu-AC_51_RoHS_L_6.pdf; Footprint Url: http://www.yageo.com/exep/pages/download/literatures/PYu-R_Mount_10.pdf; Power Rating: 0.0625W; RoHS: TRUE; Category: Res; Package: AC0402; Octopart: https://octopart.com/ac0402fr-7d100kl-yageo-91024821; Device Class L2: Resistors; Series: AC; Height: 0.37mm; ComponentLink2Description: Datasheet; Lead Free: Yes; Temperature Range Low: -55°C; Value: 100KΩ; Temperature: -55°C to +155°C; Ipc Land Pattern Name: RESC10050X32; Device Class L3: Chip SMD Resistors; Manufacturer Part Number: AC0402FR-7D100KL; Composition: Thick Film
U_EN1 = EMG_R5_U_EN1: Pushbutton On / Off  Controller with µP Interrupt, 8-pin SOT23 (TS8-8), -40 to 85 degC, Pb-Free, Mini Tape and Reel; Manufacturer: Linear Technology; Number of Supplies(#): 1; Controlled Revision: R5 2026-09-16; project-local frozen symbol/footprint; ComponentLink2URL: http://cds.linear.com/docs/en/datasheet/2954fb.pdf; DatasheetVersion: Rev. B; ComponentLink2Description: Datasheet; ComponentLink1URL: http://www.linear.com/; Packing: Mini Tape and Reel; ComponentLink3Description: Package Specification; PartNumber: LTC2954ITS8-1#TRMPBF; Code_JEDEC: MO-193; RoHS: TRUE; Mounting Technology: Surface Mount; PackageVersion: Rev. A, 08/2010; PackageDescription: 8-Pin Plastic TSOT-23, Body 2.9 x 1.63 mm, Pitch 0.65 mm; PackageReference: TS8-8; ComponentLink1Description: Manufacturer URL; ComponentLink3URL: http://cds.linear.com/docs/en/packaging/SOT_8_05-08-1637.pdf
U_UV1 = EMG_R5_U_UV1: Low Quiescent Current, Programmable-Delay Supervisory Circuit, 1 Supply Monitored, -40 to 125 degC, 6-pin SOT-23 (DBV), Green (RoHS & no Sb/Br); Manufacturer: Texas Instruments; Iq(Typ)(uA): 2.4; VCC(Min)(V): 1.7; Output Driver Type / Reset Output: Active-low, Open-drain; Rating: Catalog; SubFamily: Supervisor and Reset IC; # of Supplies Monitored: 1; Threshold Voltage 1 (typ)(Typ)(V): 3.07; Reset Threshold Accuracy(%): 0.5; VCC(Max)(V): 6.5; Controlled Revision: R5 2026-09-16; project-local frozen symbol/footprint; Code_JEDEC: MO-178-AB*; PackageVersion: revK, Mar-2006; PackageDescription: 6-Pin Plastic Small-Outline Package, 2.9 x 1.6 mm Body, 0.95 mm Pitch, 2.8 mm Lead Span; PartNumber: TPS3808G33DBVR; DatasheetVersion: SBVS050J; Mounting Technology: Surface Mount; ComponentLink1Description: Datasheet; Time Delay(ms): Programmable; ComponentLink1URL: http://www.ti.com/general/docs/lit/getliterature.tsp?genericPartNumber=TPS3808G33&fileType=pdf; PackageReference: DBV0006A
UP1 = EMG_R5_UP1: BQ24072T single-cell Li-ion charger with dynamic power path; OUT tracks battery +225mV with 3.4V minimum regulation under USB power; Manufacturer: Texas Instruments; Eco-Plan: Green (RoHS & no Sb/Br); Over Voltage Protection: N; Li-Ion: Y; SubFamily: Battery Charge Management; Vin(Min)(V): 4.3; Controlled Revision: R5 2026-09-16; project-local frozen symbol/footprint; Code_JEDEC: MO-220; ComponentLink1Description: Datasheet; Mounting Technology: Surface Mount; PartNumber: BQ24072TRGTR; Lead Acid: N; Li-Polymer: Y; NiMH: N; DatasheetVersion: SLUS937A; NiCd: N; ComponentLink1URL: http://www.ti.com/general/docs/lit/getliterature.tsp?genericPartNumber=BQ24072T&fileType=pdf; PackageDescription: 16-Pin Plastic Quad Flat No-Lead, 3 x 3 mm Body, 0.5 mm Pitch, 1.7 x 1.7 mm Exposed Pad; PackageReference: RGT0016C; PackageVersion: revH, Oct-2011; Manufacturer Part Number: BQ24072TRGTR
UP2 = EMG_R5_UP2: 1.5-A output current, high-power-density buck-boost converter; MF: Texas Instruments; Controlled Revision: R5 2026-09-16; project-local frozen symbol/footprint; SnapEDA_Link: https://www.snapeda.com/parts/TPS631000DRLR/Texas+Instruments/view-part/?ref=snap; Package: SOT-583 Texas Instruments; Value: *; MP: TPS631000DRLR; Check_prices: https://www.snapeda.com/parts/TPS631000DRLR/Texas+Instruments/view-part/?ref=eda
UP3 = EMG_R5_UP3: IC REG LINEAR 3V 300MA SOT23-5; Controlled Revision: R5 2026-09-16; project-local frozen symbol/footprint; RoHS Compliant: Yes
UP4 = EMG_R5_UP4: 3ÂµA 1-Cell/2-Cell Fuel Gauge with ModelGauge; MF: Analog Devices; Controlled Revision: R5 2026-09-16; project-local frozen symbol/footprint; Package: TDFN-8 Maxim; Price: None; Check_prices: https://www.snapeda.com/parts/MAX17048G+T10/Analog+Devices/view-part/?ref=eda; Value: *; SnapEDA_Link: https://www.snapeda.com/parts/MAX17048G+T10/Analog+Devices/view-part/?ref=snap; MP: MAX17048G+T10; Availability: In Stock; Purchase-URL: https://pricing.snapeda.com/search/part/MAX17048G+T10/?ref=eda

## Assembly variants
PROTO_1: not fitted C_WIFI_BULK C_WIFI_X32_IN C_WIFI_X32_OUT R_TH_BAT
PROTO_1_REMOTE_NTC: not fitted C_DRL_DEC C_DRL_FB C_WIFI_BULK C_WIFI_X32_IN C_WIFI_X32_OUT J_SWD JP_WIFI_BOOT R_DRL_FB R_DRL_OUT1 R_DRL_OUT2 R_DRL_SEL R_DRL_VA1 R_DRL_VA2 R_DRL_VA3 R_DRL_VA4 R_DRL_VA5 R_DRL_VB1 R_DRL_VB2 R_DRL_VB3 R_DRL_VB4 R_DRL_VB5 R_DRL_VC1 R_DRL_VC2 R_DRL_VC3 R_DRL_VC4 R_DRL_VC5 TP_GND TP_MCU_BOOT0 TP_WIFI_BOOT TP_WIFI_CHIP_EN TP_WIFI_UART_RX TP_WIFI_UART_TX U_DRL1